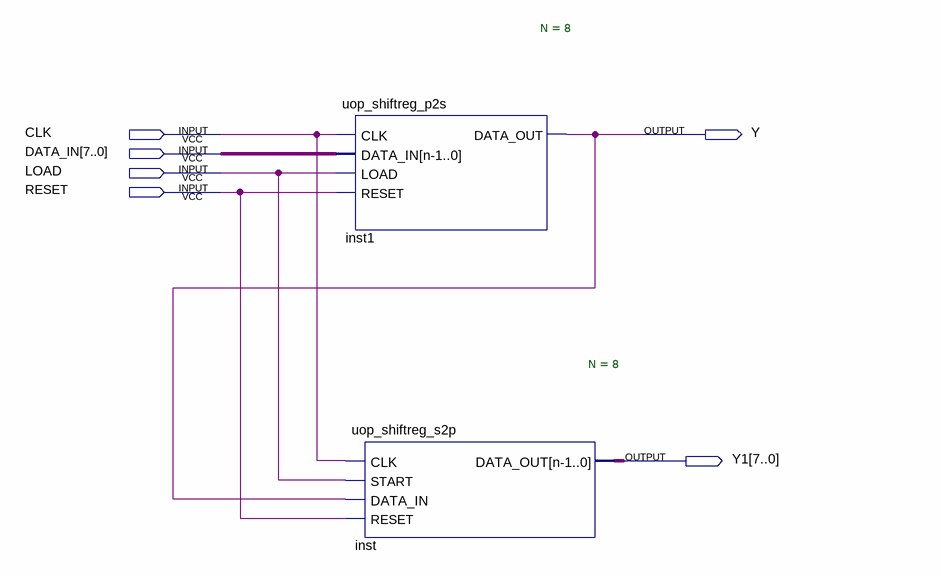
[diagram p0: schematic sheet]
// Quartus schematic behavioural.bdf as structural Verilog: 2 symbols, 6 pins
module behavioural (
  input  CLK,
  input  [7:0] DATA_IN,
  input  LOAD,
  input  RESET,
  output Y,
  output [7:0] Y1
);

  uop_shiftreg_p2s #(.N(8)) inst1 (.CLK(CLK), .DATA_IN(DATA_IN), .LOAD(LOAD), .RESET(RESET), .DATA_OUT(Y));
  uop_shiftreg_s2p #(.N(8)) inst (.CLK(CLK), .START(LOAD), .DATA_IN(Y), .RESET(RESET), .DATA_OUT(Y1));
endmodule
